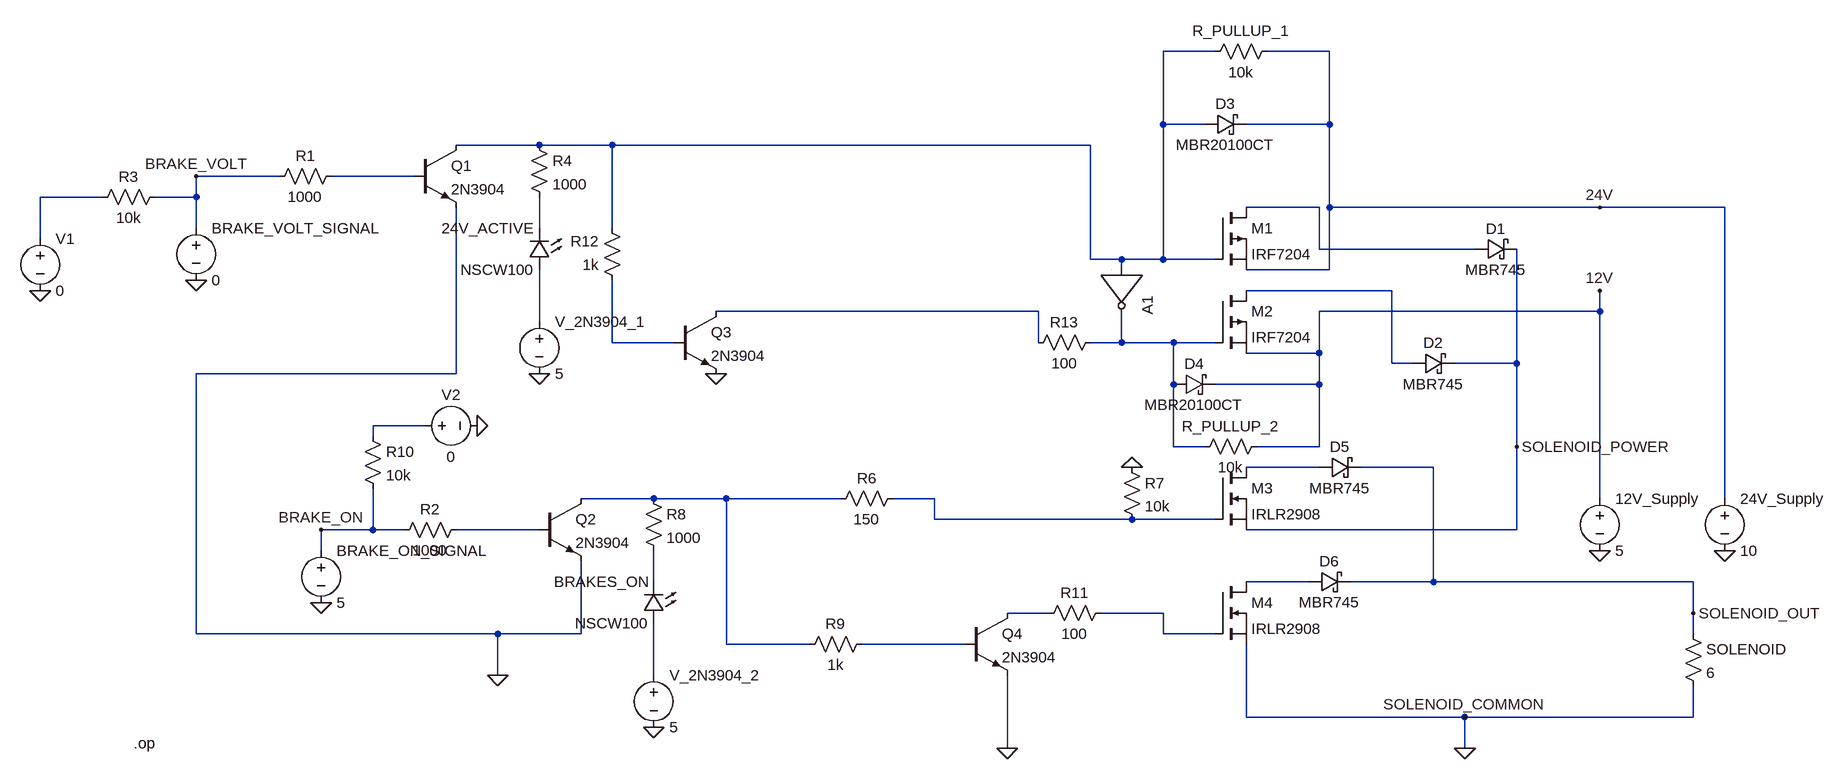
[diagram p0: schematic MOSFET_SWITCH_CIRCUIT_ANALYSIS_LOW_LEVEL_4.1_V3A.asc]
MOSFET_SWITCH_CIRCUIT_ANALYSIS_LOW_LEVEL_4.1_V3A.asc, the LTspice schematic file:
Version 4
SHEET 1 1076 1412
WIRE 128 -240 48 -240
WIRE 304 -240 208 -240
WIRE 48 -128 48 -240
WIRE 112 -128 48 -128
WIRE 304 -128 304 -240
WIRE 304 -128 176 -128
WIRE -912 -96 -1040 -96
WIRE -800 -96 -912 -96
WIRE -64 -96 -800 -96
WIRE -1312 -48 -1440 -48
WIRE -1104 -48 -1232 -48
WIRE -1584 -16 -1680 -16
WIRE -1440 -16 -1440 -48
WIRE -1440 -16 -1504 -16
WIRE 288 0 176 0
WIRE 304 0 304 -128
WIRE 720 0 304 0
WIRE 912 0 720 0
WIRE -1440 32 -1440 -16
WIRE -912 32 -912 -16
WIRE -800 32 -800 -96
WIRE -1680 48 -1680 -16
WIRE 288 64 288 0
WIRE 528 64 288 64
WIRE -64 80 -64 -96
WIRE -16 80 -64 80
WIRE 48 80 48 -128
WIRE 48 80 -16 80
WIRE 128 80 48 80
WIRE -16 96 -16 80
WIRE 304 96 304 0
WIRE 304 96 176 96
WIRE 400 128 176 128
WIRE -144 160 -640 160
WIRE 720 160 720 128
WIRE 720 160 288 160
WIRE -912 176 -912 96
WIRE -800 208 -800 112
WIRE -704 208 -800 208
WIRE -144 208 -144 160
WIRE -16 208 -16 160
WIRE -16 208 -64 208
WIRE 64 208 -16 208
WIRE 128 208 64 208
WIRE 288 224 288 160
WIRE 288 224 176 224
WIRE 400 240 400 128
WIRE 432 240 400 240
WIRE 592 240 592 64
WIRE 592 240 496 240
WIRE -1040 256 -1040 0
WIRE -1040 256 -1440 256
WIRE 64 272 64 208
WIRE 288 272 288 224
WIRE 288 272 128 272
WIRE -1088 336 -1168 336
WIRE -1168 352 -1168 336
WIRE 64 368 64 272
WIRE 112 368 64 368
WIRE 288 368 288 272
WIRE 288 368 192 368
WIRE 592 368 592 240
WIRE 288 400 176 400
WIRE 464 400 352 400
WIRE -736 448 -848 448
WIRE -624 448 -736 448
WIRE -448 448 -624 448
WIRE -304 448 -368 448
WIRE 720 448 720 160
WIRE 912 448 912 0
WIRE -304 480 -304 448
WIRE 0 480 -304 480
WIRE 128 480 0 480
WIRE -1168 496 -1168 432
WIRE -1168 496 -1248 496
WIRE -1120 496 -1168 496
WIRE -912 496 -1040 496
WIRE 592 496 592 368
WIRE 592 496 176 496
WIRE -1248 528 -1248 496
WIRE -736 576 -736 528
WIRE 272 576 176 576
WIRE 464 576 464 400
WIRE 464 576 336 576
WIRE 864 576 464 576
WIRE -128 624 -192 624
WIRE 48 624 -48 624
WIRE 864 624 864 576
WIRE -1440 656 -1440 256
WIRE -976 656 -1440 656
WIRE -848 656 -848 544
WIRE -848 656 -976 656
WIRE 48 656 48 624
WIRE 128 656 48 656
WIRE 864 656 864 624
WIRE -624 672 -624 448
WIRE -496 672 -624 672
WIRE -256 672 -416 672
WIRE -976 720 -976 656
WIRE -736 720 -736 640
WIRE 176 784 176 672
WIRE 512 784 176 784
WIRE 864 784 864 736
WIRE 864 784 512 784
WIRE -192 832 -192 720
WIRE 512 832 512 784
FLAG -1440 -48 BRAKE_VOLT
FLAG -1248 496 BRAKE_ON
FLAG 720 128 12V
FLAG 720 0 24V
FLAG -912 256 0
FLAG -736 800 0
FLAG 0 400 0
FLAG 720 528 0
FLAG -976 720 0
FLAG 912 528 0
FLAG 592 368 SOLENOID_POWER
FLAG -1440 112 0
FLAG -1248 608 0
FLAG -1680 128 0
FLAG -1008 336 0
FLAG -192 832 0
FLAG -640 256 0
FLAG 512 832 0
FLAG 512 784 SOLENOID_COMMON
FLAG 864 624 SOLENOID_OUT
DATAFLAG 592 112 ""
DATAFLAG 560 240 ""
DATAFLAG -368 -96 ""
DATAFLAG -1168 -48 ""
DATAFLAG 496 0 ""
DATAFLAG -112 480 ""
DATAFLAG 288 64 ""
DATAFLAG 336 128 ""
DATAFLAG 16 208 ""
DATAFLAG 0 80 ""
SYMBOL pmos 128 0 R0
SYMATTR InstName M1
SYMATTR Value IRF7204
SYMBOL pmos 128 128 R0
SYMATTR InstName M2
SYMATTR Value IRF7204
SYMBOL nmos 128 400 R0
SYMATTR InstName M3
SYMATTR Value IRLR2908
SYMBOL schottky 112 -112 R270
WINDOW 0 32 32 VTop 2
WINDOW 3 0 32 VBottom 2
SYMATTR InstName D3
SYMATTR Value MBR20100CT
SYMATTR Description Diode
SYMATTR Type diode
SYMBOL schottky 64 288 R270
WINDOW 0 32 32 VTop 2
WINDOW 3 0 32 VBottom 2
SYMATTR InstName D4
SYMATTR Value MBR20100CT
SYMATTR Description Diode
SYMATTR Type diode
SYMBOL npn -1104 -96 R0
SYMATTR InstName Q1
SYMATTR Value 2N3904
SYMBOL npn -912 448 R0
SYMATTR InstName Q2
SYMATTR Value 2N3904
SYMBOL res -1216 -64 R90
WINDOW 0 0 56 VBottom 2
WINDOW 3 32 56 VTop 2
SYMATTR InstName R1
SYMATTR Value 1000
SYMBOL res -1024 480 R90
WINDOW 0 0 56 VBottom 2
WINDOW 3 32 56 VTop 2
SYMATTR InstName R2
SYMATTR Value 1000
SYMBOL res 224 -256 R90
WINDOW 0 0 56 VBottom 2
WINDOW 3 32 56 VTop 2
SYMATTR InstName R_PULLUP_1
SYMATTR Value 10k
SYMBOL res 208 352 R90
WINDOW 0 0 56 VBottom 2
WINDOW 3 32 56 VTop 2
SYMATTR InstName R_PULLUP_2
SYMATTR Value 10k
SYMBOL res -928 -112 R0
SYMATTR InstName R4
SYMATTR Value 1000
SYMBOL LED -896 96 R180
WINDOW 0 24 64 Left 2
WINDOW 3 24 0 Left 2
SYMATTR InstName 24V_ACTIVE
SYMATTR Value NSCW100
SYMBOL voltage -912 160 R0
WINDOW 123 0 0 Left 0
WINDOW 39 0 0 Left 0
SYMATTR InstName V_2N3904_1
SYMATTR Value 5
SYMBOL res -352 432 R90
WINDOW 0 0 56 VBottom 2
WINDOW 3 32 56 VTop 2
SYMATTR InstName R6
SYMATTR Value 150
SYMBOL res -752 432 R0
SYMATTR InstName R8
SYMATTR Value 1000
SYMBOL voltage -736 704 R0
WINDOW 123 0 0 Left 0
WINDOW 39 0 0 Left 0
SYMATTR InstName V_2N3904_2
SYMATTR Value 5
SYMBOL LED -720 640 R180
WINDOW 0 24 64 Left 2
WINDOW 3 24 0 Left 2
SYMATTR InstName BRAKES_ON
SYMATTR Value NSCW100
SYMBOL res -16 384 R0
SYMATTR InstName R7
SYMATTR Value 10k
SYMBOL voltage 720 432 R0
WINDOW 123 0 0 Left 0
WINDOW 39 0 0 Left 0
SYMATTR InstName 12V_Supply
SYMATTR Value 5
SYMBOL voltage 912 432 R0
WINDOW 123 0 0 Left 0
WINDOW 39 0 0 Left 0
SYMATTR InstName 24V_Supply
SYMATTR Value 10
SYMBOL voltage -1440 16 R0
WINDOW 123 0 0 Left 0
WINDOW 39 0 0 Left 0
SYMATTR InstName BRAKE_VOLT_SIGNAL
SYMATTR Value 0
SYMBOL voltage -1248 512 R0
WINDOW 123 0 0 Left 0
WINDOW 39 0 0 Left 0
SYMATTR InstName BRAKE_ON_SIGNAL
SYMATTR Value 5
SYMBOL res -1488 -32 R90
WINDOW 0 0 56 VBottom 2
WINDOW 3 32 56 VTop 2
SYMATTR InstName R3
SYMATTR Value 10k
SYMBOL res -1184 336 R0
SYMATTR InstName R10
SYMATTR Value 10k
SYMBOL voltage -1680 32 R0
WINDOW 123 0 0 Left 0
WINDOW 39 0 0 Left 0
SYMATTR InstName V1
SYMATTR Value 0
SYMBOL voltage -1104 336 R270
WINDOW 0 32 56 VTop 2
WINDOW 3 -32 56 VBottom 2
WINDOW 123 0 0 Left 0
WINDOW 39 0 0 Left 0
SYMATTR InstName V2
SYMATTR Value 0
SYMBOL npn -704 160 R0
SYMATTR InstName Q3
SYMATTR Value 2N3904
SYMBOL npn -256 624 R0
SYMATTR InstName Q4
SYMATTR Value 2N3904
SYMBOL schottky 528 80 R270
WINDOW 0 32 32 VTop 2
WINDOW 3 0 32 VBottom 2
SYMATTR InstName D1
SYMATTR Value MBR745
SYMATTR Description Diode
SYMATTR Type diode
SYMBOL schottky 432 256 R270
WINDOW 0 32 32 VTop 2
WINDOW 3 0 32 VBottom 2
SYMATTR InstName D2
SYMATTR Value MBR745
SYMATTR Description Diode
SYMATTR Type diode
SYMBOL nmos 128 576 R0
SYMATTR InstName M4
SYMATTR Value IRLR2908
SYMBOL res -400 656 R90
WINDOW 0 0 56 VBottom 2
WINDOW 3 32 56 VTop 2
SYMATTR InstName R9
SYMATTR Value 1k
SYMBOL res -32 608 R90
WINDOW 0 0 56 VBottom 2
WINDOW 3 32 56 VTop 2
SYMATTR InstName R11
SYMATTR Value 100
SYMBOL res -784 128 R180
WINDOW 0 36 76 Left 2
WINDOW 3 36 40 Left 2
SYMATTR InstName R12
SYMATTR Value 1k
SYMBOL res -48 192 R90
WINDOW 0 0 56 VBottom 2
WINDOW 3 32 56 VTop 2
SYMATTR InstName R13
SYMATTR Value 100
SYMBOL res 848 640 R0
SYMATTR InstName SOLENOID
SYMATTR Value 6
SYMBOL schottky 288 416 R270
WINDOW 0 32 32 VTop 2
WINDOW 3 0 32 VBottom 2
SYMATTR InstName D5
SYMATTR Value MBR745
SYMATTR Description Diode
SYMATTR Type diode
SYMBOL schottky 272 592 R270
WINDOW 0 32 32 VTop 2
WINDOW 3 0 32 VBottom 2
SYMATTR InstName D6
SYMATTR Value MBR745
SYMATTR Description Diode
SYMATTR Type diode
SYMBOL Digital\\inv 48 96 R90
SYMATTR InstName A1
TEXT -1536 824 Left 2 !.op

The netlist it stands for:
* MOSFET_SWITCH_CIRCUIT_ANALYSIS_LOW_LEVEL_4.1_V3A.asc
M1 N004 N001 24V 24V IRF7204
M2 N006 N010 12V 12V IRF7204
M3 N012 N014 SOLENOID_POWER SOLENOID_POWER IRLR2908
D3 N001 24V MBR20100CT
D4 N010 12V MBR20100CT
Q1 N001 N002 0 0 2N3904
Q2 N013 N015 0 0 2N3904
R1 N002 BRAKE_VOLT 1000
R2 N015 BRAKE_ON 1000
R_PULLUP_1 24V N001 10k
R_PULLUP_2 12V N010 10k
R4 N001 N005 1000
D§24V_ACTIVE N008 N005 NSCW100
V_2N3904_1 N008 0 5
R6 N014 N013 150
R8 N013 N016 1000
V_2N3904_2 N021 0 5
D§BRAKES_ON N021 N016 NSCW100
R7 0 N014 10k
V§12V_Supply 12V 0 5
V§24V_Supply 24V 0 10
V§BRAKE_VOLT_SIGNAL BRAKE_VOLT 0 0
V§BRAKE_ON_SIGNAL BRAKE_ON 0 5
R3 BRAKE_VOLT N003 10k
R10 N011 BRAKE_ON 10k
V1 N003 0 0
V2 N011 0 0
Q3 N007 N009 0 0 2N3904
Q4 N018 N020 0 0 2N3904
D1 N004 SOLENOID_POWER MBR745
D2 N006 SOLENOID_POWER MBR745
M4 N017 N019 0 0 IRLR2908
R9 N020 N013 1k
R11 N019 N018 100
R12 N009 N001 1k
R13 N010 N007 100
R§SOLENOID SOLENOID_OUT 0 6
D5 N012 SOLENOID_OUT MBR745
D6 N017 SOLENOID_OUT MBR745
A1 N001 0 0 0 0 N010 0 0 BUF
.model D D
.lib standard.dio
.model NPN NPN
.model PNP PNP
.lib standard.bjt
.model NMOS NMOS
.model PMOS PMOS
.lib standard.mos
.op
.backanno
.end